# EAGLE design Apex_CV_Expander_UI (EAGLE 9.5.2)
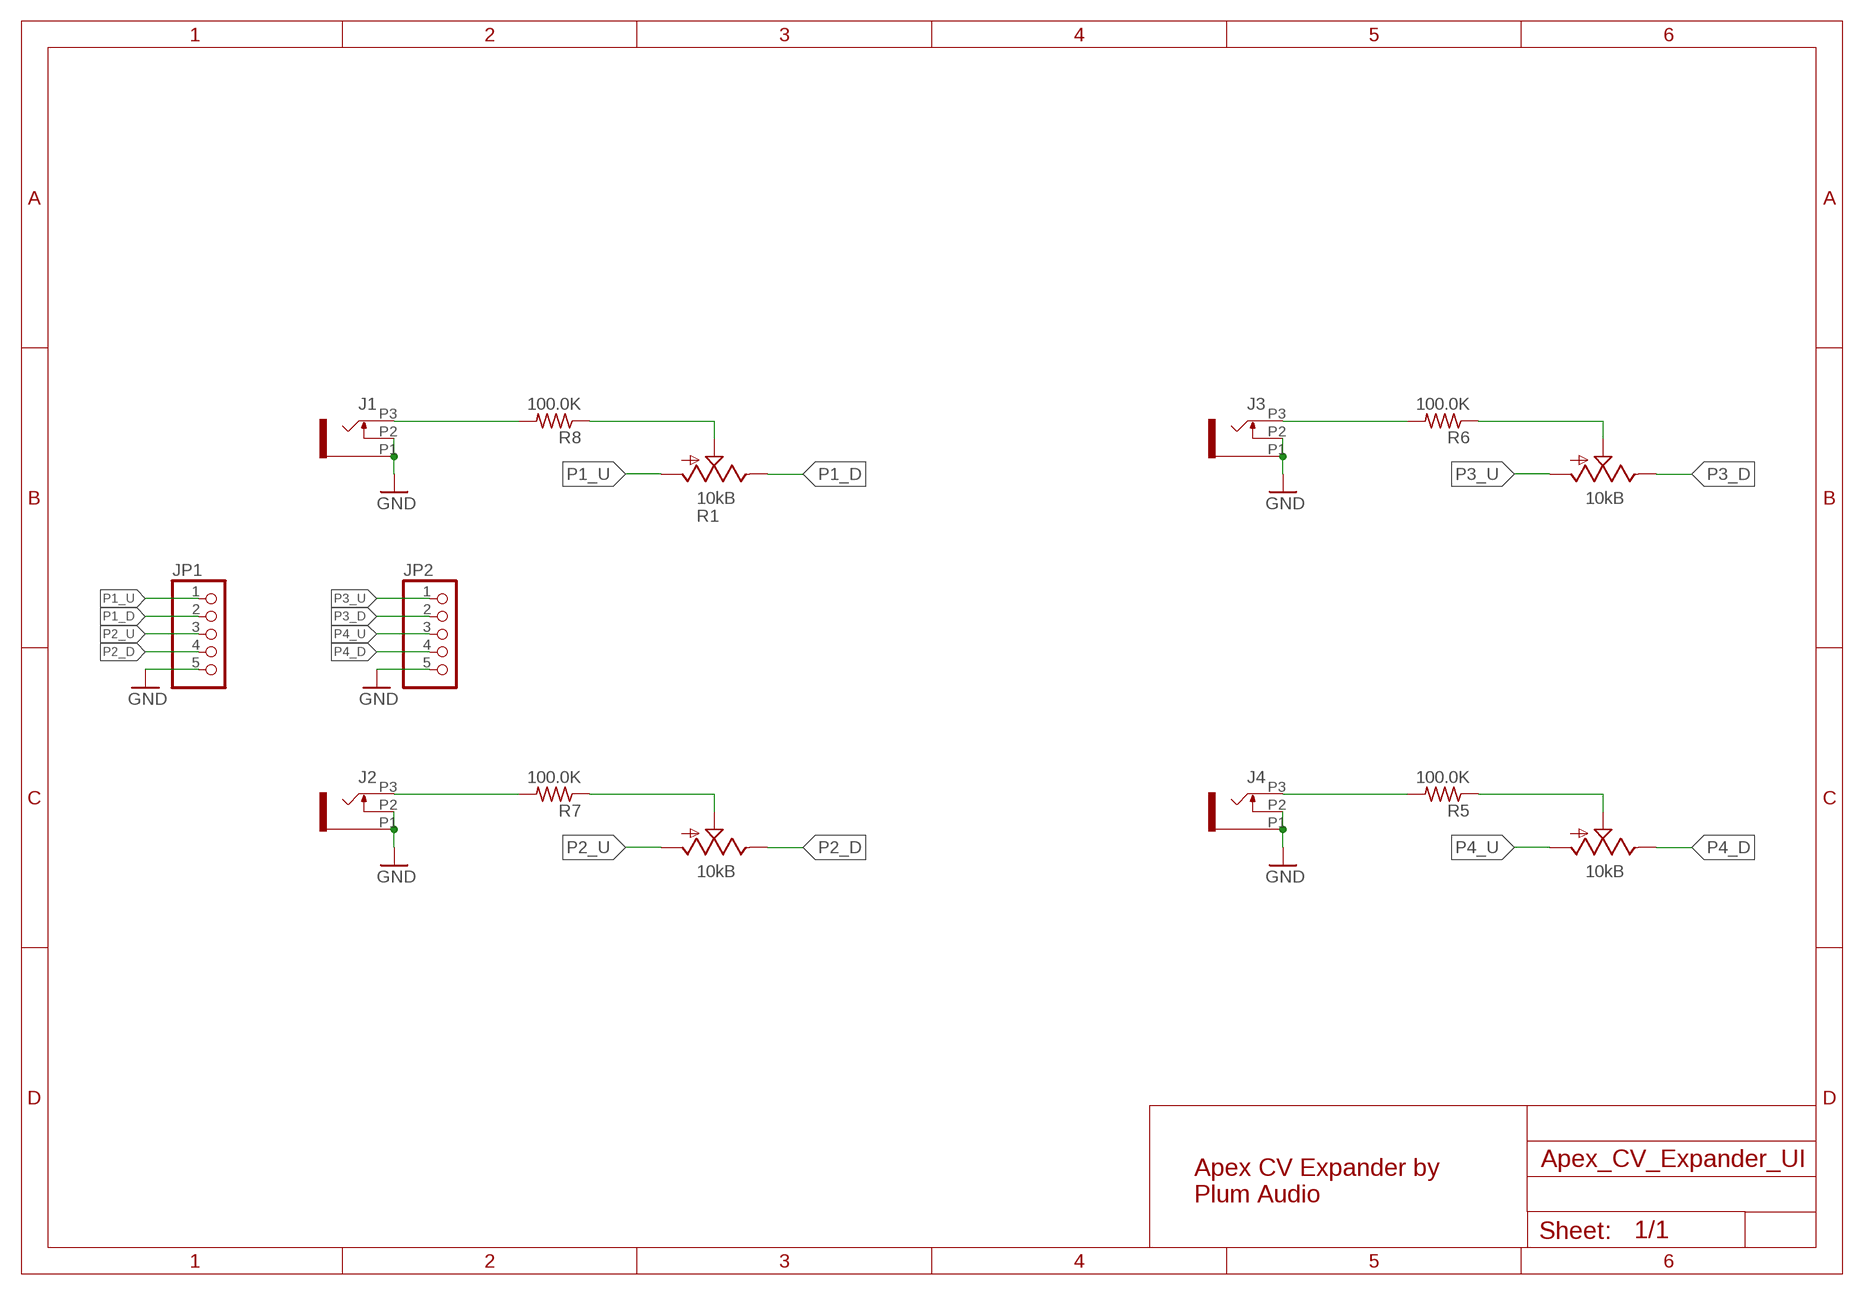
[diagram p0: schematic, sheet 1]

## Parts
J1  OG-PJ301_PJ301_THONKICONN6  [OG-PJ301_WQP_PJ_301M6]
J2  OG-PJ301_PJ301_THONKICONN6  [OG-PJ301_WQP_PJ_301M6]
J3  OG-PJ301_PJ301_THONKICONN6  [OG-PJ301_WQP_PJ_301M6]
J4  OG-PJ301_PJ301_THONKICONN6  [OG-PJ301_WQP_PJ_301M6]
JP1  PINHD-1X5  [1X05]
JP2  PINHD-1X5  [1X05]
R1  10kB  POTS_POT_USSLOTED_TALL_TRIMMER  [POTS_TALL_TRIMMER_POT_VERTICAL_SLOTED]
R2  10kB  POTS_POT_USSLOTED_TALL_TRIMMER  [POTS_TALL_TRIMMER_POT_VERTICAL_SLOTED]
R3  10kB  POTS_POT_USSLOTED_TALL_TRIMMER  [POTS_TALL_TRIMMER_POT_VERTICAL_SLOTED]
R4  10kB  POTS_POT_USSLOTED_TALL_TRIMMER  [POTS_TALL_TRIMMER_POT_VERTICAL_SLOTED]
R5  100.0K  R-US_R0603  [R0603]
R6  100.0K  R-US_R0603  [R0603]
R7  100.0K  R-US_R0603  [R0603]
R8  100.0K  R-US_R0603  [R0603]

## Nets
GND: J1.P1 J1.P2 J2.P1 J2.P2 J3.P1 J3.P2 J4.P1 J4.P2 JP1.5 JP2.5
N$1: J1.P3 R8.2
N$2: R1.P$2(S) R8.1
N$7: J2.P3 R7.2
N$8: R2.P$2(S) R7.1
N$13: J3.P3 R6.2
N$14: R3.P$2(S) R6.1
N$19: J4.P3 R5.2
N$20: R4.P$2(S) R5.1
P1_D: JP1.2 R1.P$1(E)
P1_U: JP1.1 R1.P$3(A)
P2_D: JP1.4 R2.P$1(E)
P2_U: JP1.3 R2.P$3(A)
P3_D: JP2.2 R3.P$1(E)
P3_U: JP2.1 R3.P$3(A)
P4_D: JP2.4 R4.P$1(E)
P4_U: JP2.3 R4.P$3(A)

## Notes on the sheet
- Apex CV Expander by 
  Plum Audio

## Library data of the parts
J1-J4 = SHAY_THONKICONNS:OG-PJ301_PJ301_THONKICONN
JP1 JP2 = pinhead:PINHD-1X5: PIN HEADER
R1-R4 = POTS:POTS_POT_US
R5-R8 = rcl:R-US_: RESISTOR, American symbol

## Board
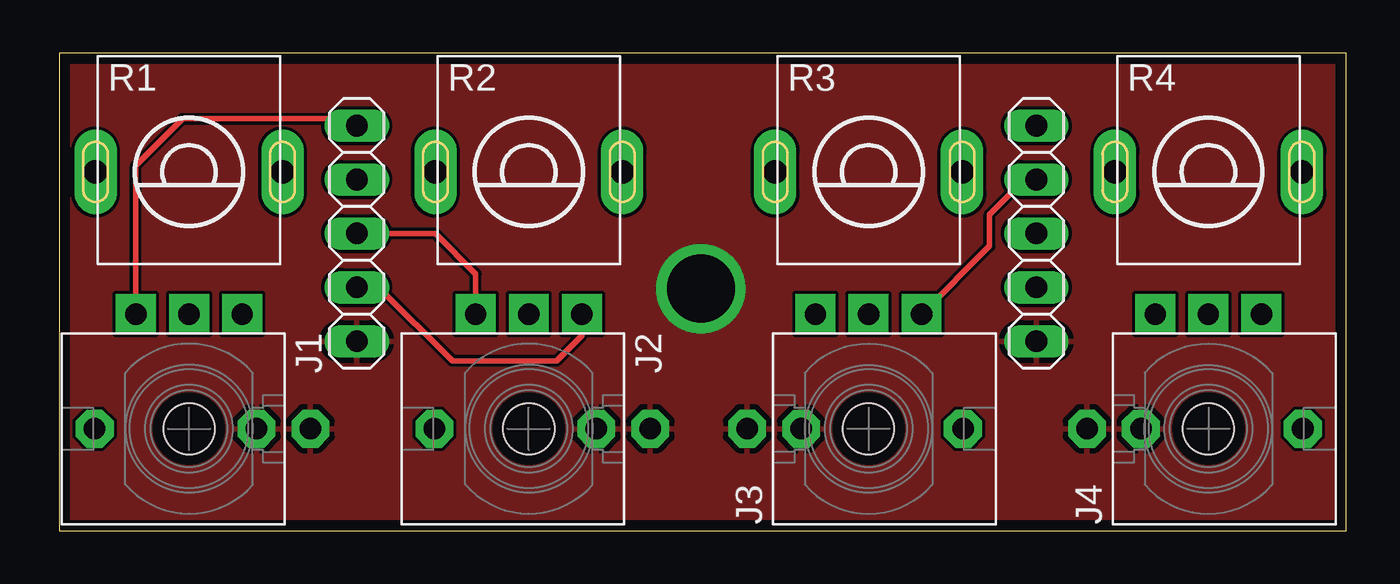
[diagram p1: board, top side]
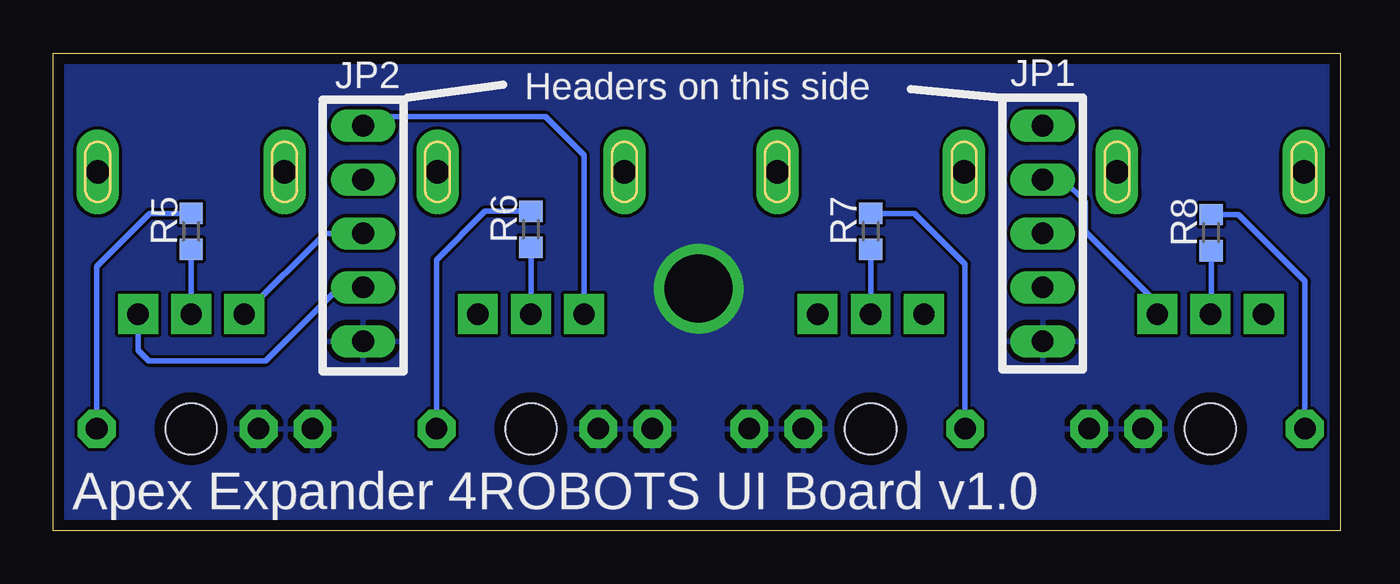
[diagram p2: board, bottom side, seen from below]

Size 60.6 x 22.5 mm. Coordinates in mm from the lower left corner, seen from the top.
Outline: 0,0 60.6,0 60.6,22.5 0,22.5 0,0
Copper layers (1*16): Top 0.035mm / dielectric 1.5mm / Bottom 0.035mm
Design rules "default *": minimum track width 6mil, minimum drill 0.35mm, track to track 6mil, track to pad 6mil, pad to pad 6mil, via to via 6mil, smd to smd 6mil, copper to edge 20mil, drill to drill 6mil, minimum pad ring 10mil, minimum via ring 8mil, stop-mask expansion 4mil, vias tented up to drill 0mil, thermal gap 10mil

### Footprints (pad centres in the part's own frame; a part is rotated, then mirrored left to right if it is on the bottom)
OG-PJ301_WQP_PJ_301M6 = drill 1.016 pad 1.778 octagon: P1 0,-5.715; P2 0,-3.175; P3 0,4.445 | hole 2.4: 0,0
1X05 = drill 1.016 long: 1 -5.08,0; 2 -2.54,0; 3 0,0; 4 2.54,0; 5 5.08,0
POTS_TALL_TRIMMER_POT_VERTICAL_SLOTED = drill 1 pad 1.88 square: P$1 -2.5,6.7; P$2 0,6.7; P$3 2.5,6.7 | drill 1.1 pad 2 long: P$4 -4.4,0; P$5 4.4,0
R0603 = smd 1 x 1.1: 1 -0.85,0; 2 0.85,0

### Placement (x,y rotation side)
J1  6.1,4.8 90 top
J2  22.1,4.8 90 top
J3  38.1,4.8 270 top
J4  54.1,4.8 270 top
JP1  14,14 270 top
JP2  46,14 270 top
R1  6.1,16.9 180 top
R2  22.1,16.9 180 top
R3  38.1,16.9 180 top
R4  54.1,16.9 180 top
R5  54.1,14.1 90 bottom
R6  38.1,14.2 90 bottom
R7  22.1,14.1 90 bottom
R8  6.07,14.04 90 bottom

### Tracks (layer width: path | path; a pad name or v marks a point on that pad's centre or on a via)
GND  (via drill 3.2)
  other vias: 30.2,11.4
  pour Top: 0,0 0,22.4 0,22.5 1.1,22.5 60.6,22.5 60.6,22.1 60.6,0 54.8,0
  pour Bottom: 0,0 0,22.4 0,22.5 1.1,22.5 60.6,22.5 60.6,22.1 60.6,0 54.8,0
N$1
  Bottom 0.254: J1.P3 1.66,11.76 4.79,14.89 R8.2
N$2
  Bottom 0.254: R8.1 6.07,10.23 R1.P$2
N$7
  Bottom 0.254: J2.P3 17.66,12.55 20.05,14.95 R7.2
N$8
  Bottom 0.254: R7.1 R2.P$2
N$13
  Bottom 0.254: J3.P3 42.55,12.76 40.25,15.05 R6.2
N$14
  Bottom 0.254: R6.1 R3.P$2
N$19
  Bottom 0.254: J4.P3 58.55,12.46 56.05,14.95 R5.2
N$20
  Bottom 0.254: R5.1 R4.P$2
P1_D
  Bottom 0.254: R1.P$1 8.6,10.7 12,14.1 12,15.5 13.04,16.54 JP1.2
P1_U
  Top 0.254: R1.P$3 3.6,17.2 5.8,19.4 13.68,19.4 JP1.1
P2_D
  Top 0.254: R2.P$1 24.6,9.2 23.4,8 18.5,8 15.04,11.46 JP1.4
P2_U
  Top 0.254: R2.P$3 19.6,12.1 17.7,14 JP1.3
P3_D
  Top 0.254: R3.P$1 43.8,13.4 43.8,14.9 45.44,16.54 JP2.2
P3_U
  Bottom 0.254: R3.P$3 35.6,17.7 37.4,19.5 45.58,19.5 JP2.1
P4_D
  Bottom 0.254: R4.P$1 56.6,8.5 56.1,8 50.6,8 47.14,11.46 JP2.4
P4_U
  Bottom 0.254: R4.P$3 47.8,14 JP2.3

### Text on the board
bPlace: Headers on this side | Apex Expander 4ROBOTS UI Board v1.0